# Altium schematic sheet 32点阵.SchDoc
size A2
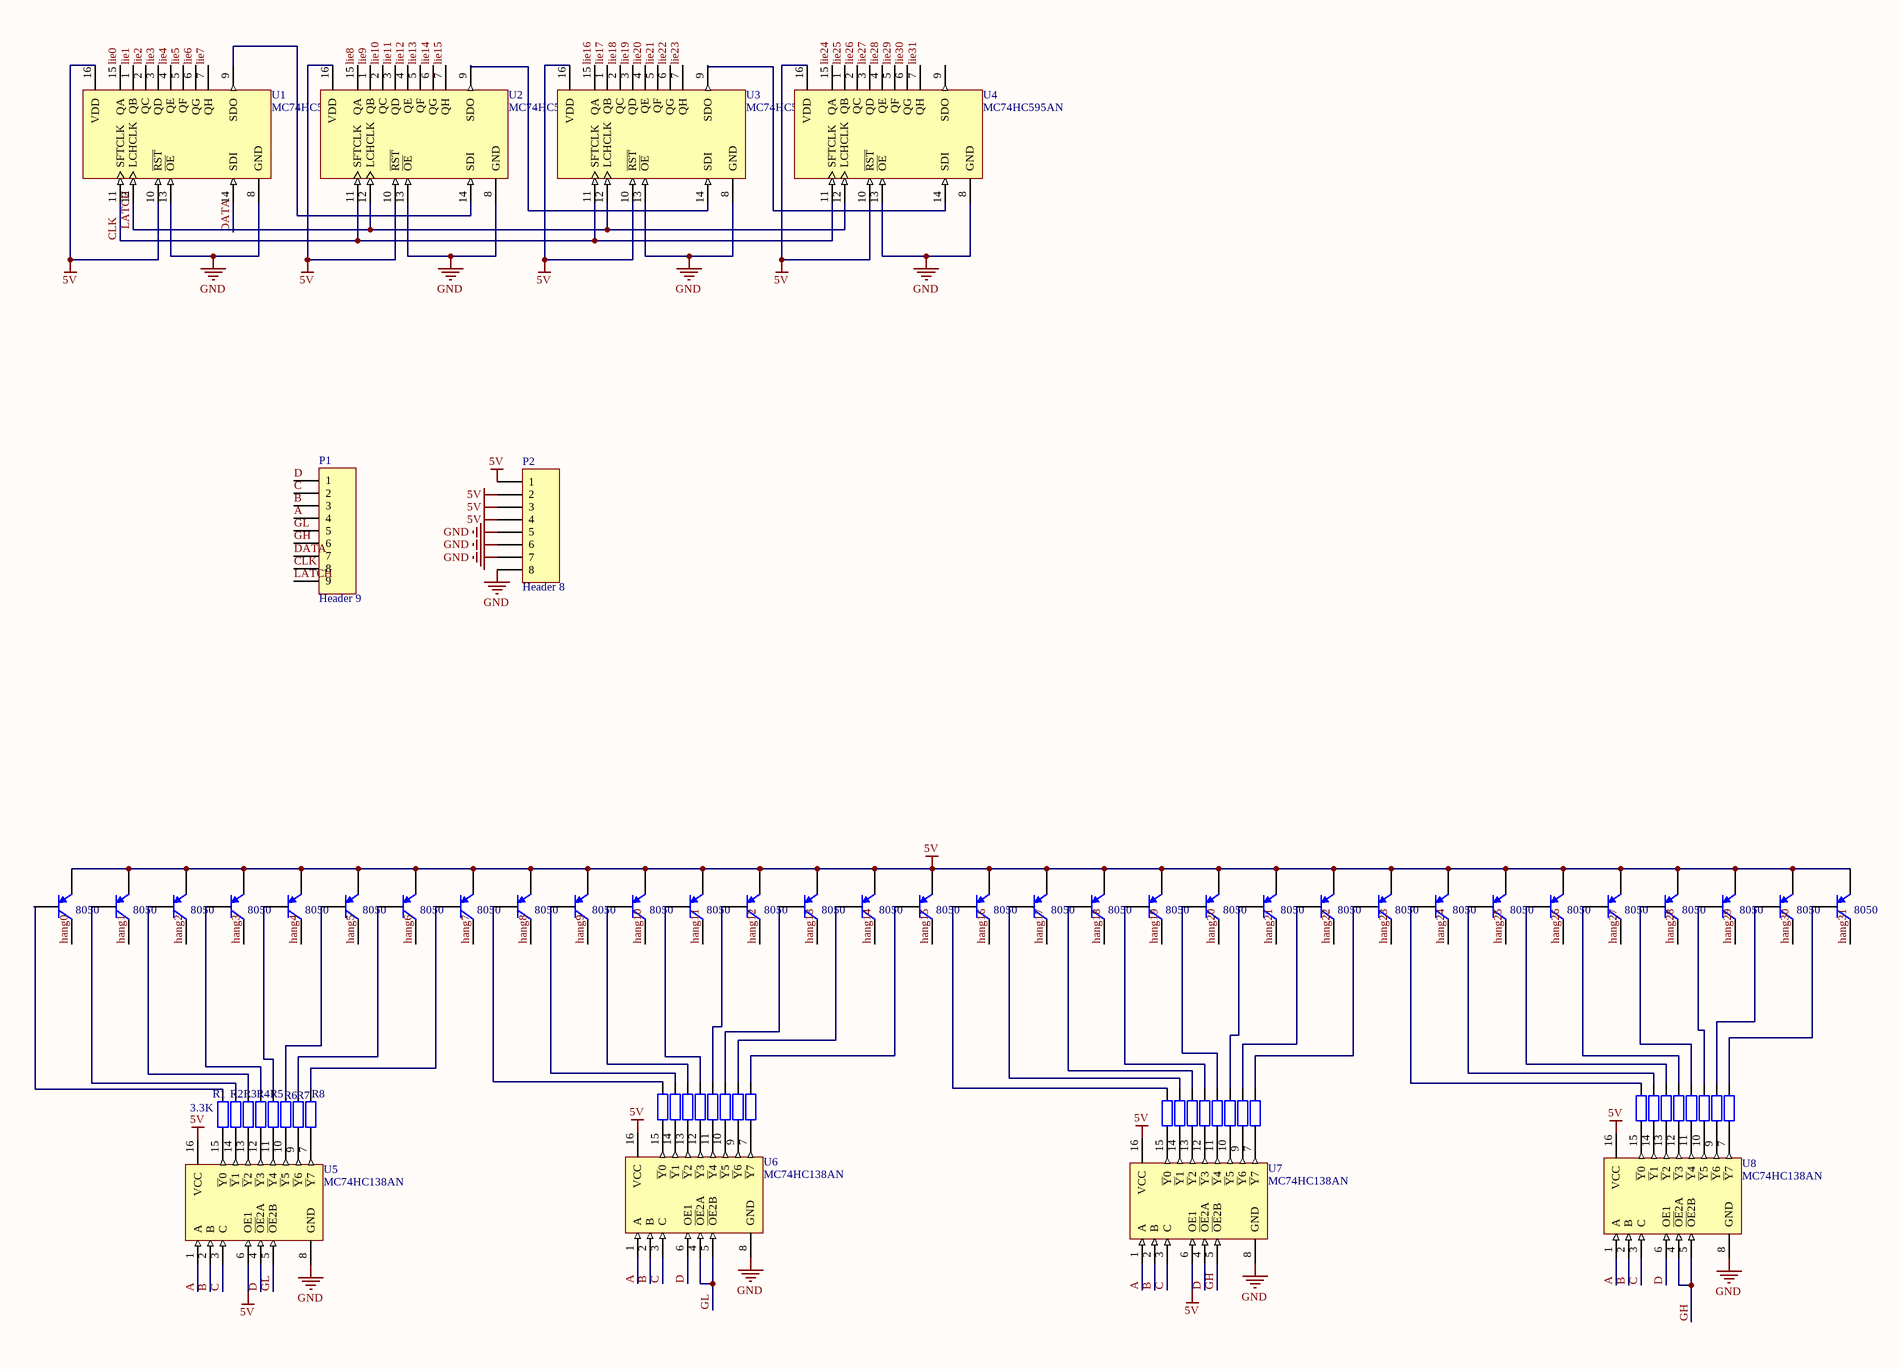
[diagram p0: 32点阵.SchDoc, left]
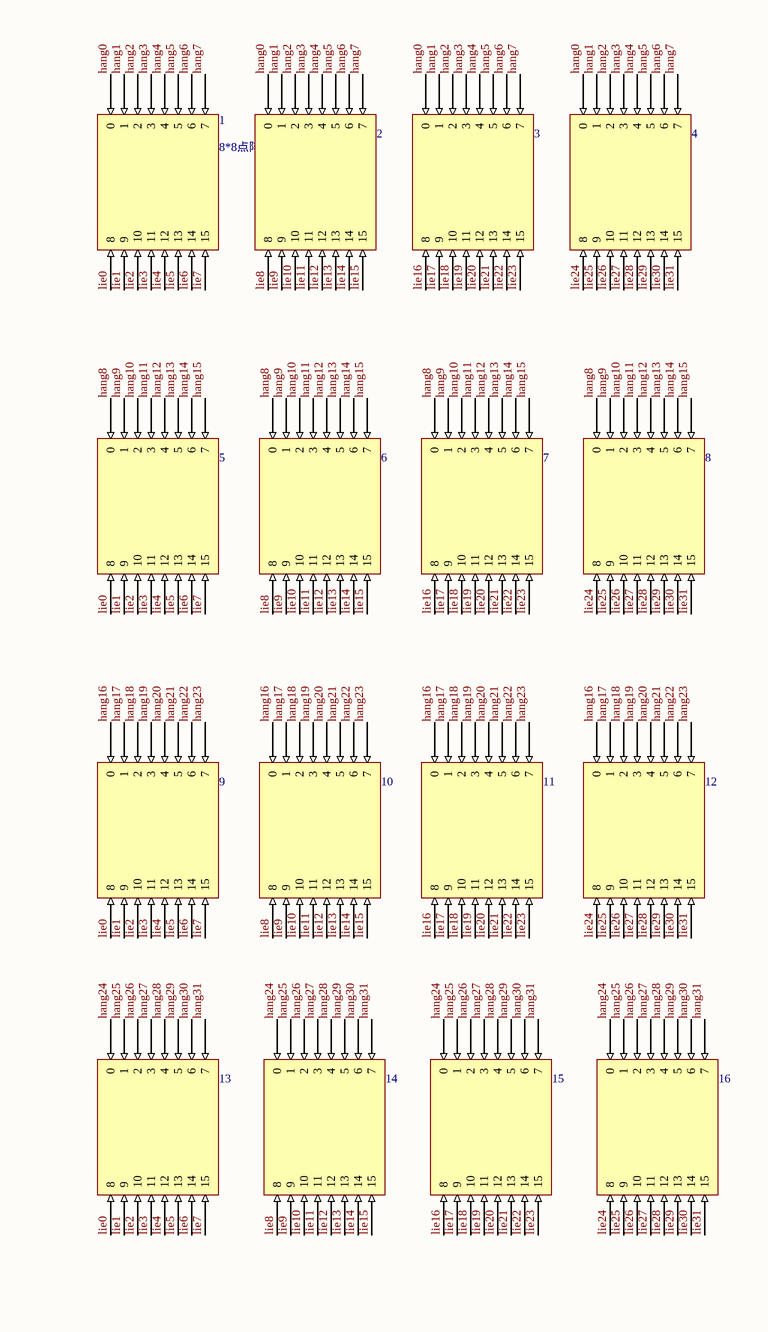
[diagram p1: 32点阵.SchDoc, right]

## Parts
1  8*8点阵: 上面行，下面列  [PCBComponent_1 - duplicate]  (hidden comment: 8乘8点阵)
2  8乘8点阵  [PCBComponent_1 - duplicate]  (value not drawn)
3  8乘8点阵  [PCBComponent_1 - duplicate]  (value not drawn)
4  8乘8点阵  [PCBComponent_1 - duplicate]  (value not drawn)
5  8乘8点阵  [PCBComponent_1 - duplicate]  (value not drawn)
6  8乘8点阵  [PCBComponent_1 - duplicate]  (value not drawn)
7  8乘8点阵  [PCBComponent_1 - duplicate]  (value not drawn)
8  8乘8点阵  [PCBComponent_1 - duplicate]  (value not drawn)
9  8乘8点阵  [PCBComponent_1 - duplicate]  (value not drawn)
10  8乘8点阵  [PCBComponent_1 - duplicate]  (value not drawn)
11  8乘8点阵  [PCBComponent_1 - duplicate]  (value not drawn)
12  8乘8点阵  [PCBComponent_1 - duplicate]  (value not drawn)
13  8乘8点阵  [PCBComponent_1 - duplicate]  (value not drawn)
14  8乘8点阵  [PCBComponent_1 - duplicate]  (value not drawn)
15  8乘8点阵  [PCBComponent_1 - duplicate]  (value not drawn)
16  8乘8点阵  [PCBComponent_1 - duplicate]  (value not drawn)
P1  Header 9  [HDR1X9]
P2  Header 8  [HDR1X8]
Q1  8050  [TO-92A]
Q2  8050  [TO-92A]
Q3  8050  [TO-92A]
Q4  8050  [TO-92A]
Q5  8050  [TO-92A]
Q6  8050  [TO-92A]
Q7  8050  [TO-92A]
Q8  8050  [TO-92A]
Q9  8050  [TO-92A]
Q10  8050  [TO-92A]
Q11  8050  [TO-92A]
Q12  8050  [TO-92A]
Q13  8050  [TO-92A]
Q14  8050  [TO-92A]
Q15  8050  [TO-92A]
Q16  8050  [TO-92A]
Q17  8050  [TO-92A]
Q18  8050  [TO-92A]
Q19  8050  [TO-92A]
Q20  8050  [TO-92A]
Q21  8050  [TO-92A]
Q22  8050  [TO-92A]
Q23  8050  [TO-92A]
Q24  8050  [TO-92A]
Q25  8050  [TO-92A]
Q26  8050  [TO-92A]
Q27  8050  [TO-92A]
Q28  8050  [TO-92A]
Q29  8050  [TO-92A]
Q30  8050  [TO-92A]
Q31  8050  [TO-92A]
Q32  8050  [TO-92A]
R1  value 3.3K  [AXIAL-0.4]  (hidden comment: Res2)
R2  Res2  [AXIAL-0.4]  (value not drawn)
R3  Res2  [AXIAL-0.4]  (value not drawn)
R4  Res2  [AXIAL-0.4]  (value not drawn)
R5  Res2  [AXIAL-0.4]  (value not drawn)
R6  Res2  [AXIAL-0.4]  (value not drawn)
R7  Res2  [AXIAL-0.4]  (value not drawn)
R8  Res2  [AXIAL-0.4]  (value not drawn)
R9  Res2  [AXIAL-0.4]  (value not drawn)
R10  Res2  [AXIAL-0.4]  (value not drawn)
R11  Res2  [AXIAL-0.4]  (value not drawn)
R12  Res2  [AXIAL-0.4]  (value not drawn)
R13  Res2  [AXIAL-0.4]  (value not drawn)
R14  Res2  [AXIAL-0.4]  (value not drawn)
R15  Res2  [AXIAL-0.4]  (value not drawn)
R16  Res2  [AXIAL-0.4]  (value not drawn)
R17  Res2  [AXIAL-0.4]  (value not drawn)
R18  Res2  [AXIAL-0.4]  (value not drawn)
R19  Res2  [AXIAL-0.4]  (value not drawn)
R20  Res2  [AXIAL-0.4]  (value not drawn)
R21  Res2  [AXIAL-0.4]  (value not drawn)
R22  Res2  [AXIAL-0.4]  (value not drawn)
R23  Res2  [AXIAL-0.4]  (value not drawn)
R24  Res2  [AXIAL-0.4]  (value not drawn)
R25  Res2  [AXIAL-0.4]  (value not drawn)
R26  Res2  [AXIAL-0.4]  (value not drawn)
R27  Res2  [AXIAL-0.4]  (value not drawn)
R28  Res2  [AXIAL-0.4]  (value not drawn)
R29  Res2  [AXIAL-0.4]  (value not drawn)
R30  Res2  [AXIAL-0.4]  (value not drawn)
R31  Res2  [AXIAL-0.4]  (value not drawn)
R32  Res2  [AXIAL-0.4]  (value not drawn)
U1  MC74HC595AN  [648-08]
U2  MC74HC595AN  [648-08]
U3  MC74HC595AN  [648-08]
U4  MC74HC595AN  [648-08]
U5  MC74HC138AN  [648-08]
U6  MC74HC138AN  [648-08]
U7  MC74HC138AN  [648-08]
U8  MC74HC138AN  [648-08]

## Nets
5V: P2.1 P2.2 P2.3 P2.4 Q1.1(E) Q2.1(E) Q3.1(E) Q4.1(E) Q5.1(E) Q6.1(E) Q7.1(E) Q8.1(E) Q9.1(E) Q10.1(E) Q11.1(E) Q12.1(E) Q13.1(E) Q14.1(E) Q15.1(E) Q16.1(E) Q17.1(E) Q18.1(E) Q19.1(E) Q20.1(E) Q21.1(E) Q22.1(E) Q23.1(E) Q24.1(E) Q25.1(E) Q26.1(E) Q27.1(E) Q28.1(E) Q29.1(E) Q30.1(E) Q31.1(E) Q32.1(E) U1.10(~{RST}) U1.16(VDD) U2.10(~{RST}) U2.16(VDD) U3.10(~{RST}) U3.16(VDD) U4.10(~{RST}) U4.16(VDD) U5.6(OE1) U5.16(VCC) U6.16(VCC) U7.6(OE1) U7.16(VCC) U8.16(VCC)
GND: P2.5 P2.6 P2.7 P2.8 U1.8(GND) U1.13(~{OE}) U2.8(GND) U2.13(~{OE}) U3.8(GND) U3.13(~{OE}) U4.8(GND) U4.13(~{OE}) U5.8(GND) U6.8(GND) U7.8(GND) U8.8(GND)
A: P1.4 U5.1(A) U6.1(A) U7.1(A) U8.1(A)
B: P1.3 U5.2(B) U6.2(B) U7.2(B) U8.2(B)
C: P1.2 U5.3(C) U6.3(C) U7.3(C) U8.3(C)
CLK: P1.8 U1.11(SFTCLK) U2.11(SFTCLK) U3.11(SFTCLK) U4.11(SFTCLK)
D: P1.1 U5.4(~{OE}2A) U6.6(OE1) U7.4(~{OE}2A) U8.6(OE1)
DATA: P1.7 U1.14(SDI)
GH: P1.6 U7.5(~{OE}2B) U8.4(~{OE}2A) U8.5(~{OE}2B)
GL: P1.5 U5.5(~{OE}2B) U6.4(~{OE}2A) U6.5(~{OE}2B)
hang0: 1.0 2.0 3.0 4.0 Q1.3(C)
hang1: 1.1 2.1 3.1 4.1 Q2.3(C)
hang2: 1.2 2.2 3.2 4.2 Q3.3(C)
hang3: 1.3 2.3 3.3 4.3 Q4.3(C)
hang4: 1.4 2.4 3.4 4.4 Q5.3(C)
hang5: 1.5 2.5 3.5 4.5 Q6.3(C)
hang6: 1.6 2.6 3.6 4.6 Q7.3(C)
hang7: 1.7 2.7 3.7 4.7 Q8.3(C)
hang8: 5.0 6.0 7.0 8.0 Q9.3(C)
hang9: 5.1 6.1 7.1 8.1 Q10.3(C)
hang10: 5.2 6.2 7.2 8.2 Q11.3(C)
hang11: 5.3 6.3 7.3 8.3 Q12.3(C)
hang12: 5.4 6.4 7.4 8.4 Q13.3(C)
hang13: 5.5 6.5 7.5 8.5 Q14.3(C)
hang14: 5.6 6.6 7.6 8.6 Q15.3(C)
hang15: 5.7 6.7 7.7 8.7 Q16.3(C)
hang16: 9.0 10.0 11.0 12.0 Q17.3(C)
hang17: 9.1 10.1 11.1 12.1 Q18.3(C)
hang18: 9.2 10.2 11.2 12.2 Q19.3(C)
hang19: 9.3 10.3 11.3 12.3 Q20.3(C)
hang20: 9.4 10.4 11.4 12.4 Q21.3(C)
hang21: 9.5 10.5 11.5 12.5 Q22.3(C)
hang22: 9.6 10.6 11.6 12.6 Q23.3(C)
hang23: 9.7 10.7 11.7 12.7 Q24.3(C)
hang24: 13.0 14.0 15.0 16.0 Q25.3(C)
hang25: 13.1 14.1 15.1 16.1 Q26.3(C)
hang26: 13.2 14.2 15.2 16.2 Q27.3(C)
hang27: 13.3 14.3 15.3 16.3 Q28.3(C)
hang28: 13.4 14.4 15.4 16.4 Q29.3(C)
hang29: 13.5 14.5 15.5 16.5 Q30.3(C)
hang30: 13.6 14.6 15.6 16.6 Q31.3(C)
hang31: 13.7 14.7 15.7 16.7 Q32.3(C)
LATCH: P1.9 U1.12(LCHCLK) U2.12(LCHCLK) U3.12(LCHCLK) U4.12(LCHCLK)
lie0: 1.8 5.8 9.8 13.8 U1.15(QA)
lie1: 1.9 5.9 9.9 13.9 U1.1(QB)
lie2: 1.10 5.10 9.10 13.10 U1.2(QC)
lie3: 1.11 5.11 9.11 13.11 U1.3(QD)
lie4: 1.12 5.12 9.12 13.12 U1.4(QE)
lie5: 1.13 5.13 9.13 13.13 U1.5(QF)
lie6: 1.14 5.14 9.14 13.14 U1.6(QG)
lie7: 1.15 5.15 9.15 13.15 U1.7(QH)
lie8: 2.8 6.8 10.8 14.8 U2.15(QA)
lie9: 2.9 6.9 10.9 14.9 U2.1(QB)
lie10: 2.10 6.10 10.10 14.10 U2.2(QC)
lie11: 2.11 6.11 10.11 14.11 U2.3(QD)
lie12: 2.12 6.12 10.12 14.12 U2.4(QE)
lie13: 2.13 6.13 10.13 14.13 U2.5(QF)
lie14: 2.14 6.14 10.14 14.14 U2.6(QG)
lie15: 2.15 6.15 10.15 14.15 U2.7(QH)
lie16: 3.8 7.8 11.8 15.8 U3.15(QA)
lie17: 3.9 7.9 11.9 15.9 U3.1(QB)
lie18: 3.10 7.10 11.10 15.10 U3.2(QC)
lie19: 3.11 7.11 11.11 15.11 U3.3(QD)
lie20: 3.12 7.12 11.12 15.12 U3.4(QE)
lie21: 3.13 7.13 11.13 15.13 U3.5(QF)
lie22: 3.14 7.14 11.14 15.14 U3.6(QG)
lie23: 3.15 7.15 11.15 15.15 U3.7(QH)
lie24: 4.8 8.8 12.8 16.8 U4.15(QA)
lie25: 4.9 8.9 12.9 16.9 U4.1(QB)
lie26: 4.10 8.10 12.10 16.10 U4.2(QC)
lie27: 4.11 8.11 12.11 16.11 U4.3(QD)
lie28: 4.12 8.12 12.12 16.12 U4.4(QE)
lie29: 4.13 8.13 12.13 16.13 U4.5(QF)
lie30: 4.14 8.14 12.14 16.14 U4.6(QG)
lie31: 4.15 8.15 12.15 16.15 U4.7(QH)
NetQ1_2: Q1.2(B) R1.2
NetQ2_2: Q2.2(B) R2.2
NetQ3_2: Q3.2(B) R3.2
NetQ4_2: Q4.2(B) R4.2
NetQ5_2: Q5.2(B) R5.2
NetQ6_2: Q6.2(B) R6.2
NetQ7_2: Q7.2(B) R7.2
NetQ8_2: Q8.2(B) R8.2
NetQ9_2: Q9.2(B) R9.2
NetQ10_2: Q10.2(B) R10.2
NetQ11_2: Q11.2(B) R11.2
NetQ12_2: Q12.2(B) R12.2
NetQ13_2: Q13.2(B) R13.2
NetQ14_2: Q14.2(B) R14.2
NetQ15_2: Q15.2(B) R15.2
NetQ16_2: Q16.2(B) R16.2
NetQ17_2: Q17.2(B) R17.2
NetQ18_2: Q18.2(B) R18.2
NetQ19_2: Q19.2(B) R19.2
NetQ20_2: Q20.2(B) R20.2
NetQ21_2: Q21.2(B) R21.2
NetQ22_2: Q22.2(B) R22.2
NetQ23_2: Q23.2(B) R23.2
NetQ24_2: Q24.2(B) R24.2
NetQ25_2: Q25.2(B) R25.2
NetQ26_2: Q26.2(B) R26.2
NetQ27_2: Q27.2(B) R27.2
NetQ28_2: Q28.2(B) R28.2
NetQ29_2: Q29.2(B) R29.2
NetQ30_2: Q30.2(B) R30.2
NetQ31_2: Q31.2(B) R31.2
NetQ32_2: Q32.2(B) R32.2
NetR1_1: R1.1 U5.15(~{Y}0)
NetR2_1: R2.1 U5.14(~{Y}1)
NetR3_1: R3.1 U5.13(~{Y}2)
NetR4_1: R4.1 U5.12(~{Y}3)
NetR5_1: R5.1 U5.11(~{Y}4)
NetR6_1: R6.1 U5.10(~{Y}5)
NetR7_1: R7.1 U5.9(~{Y}6)
NetR8_1: R8.1 U5.7(~{Y}7)
NetR9_1: R9.1 U6.15(~{Y}0)
NetR10_1: R10.1 U6.14(~{Y}1)
NetR11_1: R11.1 U6.13(~{Y}2)
NetR12_1: R12.1 U6.12(~{Y}3)
NetR13_1: R13.1 U6.11(~{Y}4)
NetR14_1: R14.1 U6.10(~{Y}5)
NetR15_1: R15.1 U6.9(~{Y}6)
NetR16_1: R16.1 U6.7(~{Y}7)
NetR17_1: R17.1 U7.15(~{Y}0)
NetR18_1: R18.1 U7.14(~{Y}1)
NetR19_1: R19.1 U7.13(~{Y}2)
NetR20_1: R20.1 U7.12(~{Y}3)
NetR21_1: R21.1 U7.11(~{Y}4)
NetR22_1: R22.1 U7.10(~{Y}5)
NetR23_1: R23.1 U7.9(~{Y}6)
NetR24_1: R24.1 U7.7(~{Y}7)
NetR25_1: R25.1 U8.15(~{Y}0)
NetR26_1: R26.1 U8.14(~{Y}1)
NetR27_1: R27.1 U8.13(~{Y}2)
NetR28_1: R28.1 U8.12(~{Y}3)
NetR29_1: R29.1 U8.11(~{Y}4)
NetR30_1: R30.1 U8.10(~{Y}5)
NetR31_1: R31.1 U8.9(~{Y}6)
NetR32_1: R32.1 U8.7(~{Y}7)
NetU1_9: U1.9(SDO) U2.14(SDI)
NetU2_9: U2.9(SDO) U3.14(SDI)
NetU3_9: U3.9(SDO) U4.14(SDI)

Not connected (* = marked no-connect by the designer): U4 9(SDO)

## Library data of the parts
2-16 = 8乘8点阵: 8*8点阵: 上面行，下面列
P1 = Header 9: Header, 9-Pin; LatestRevisionDate: 17-Jul-2002; LatestRevisionNote: Re-released for DXP Platform.; Publisher: Altium Limited
P2 = Header 8: Header, 8-Pin; LatestRevisionDate: 17-Jul-2002; LatestRevisionNote: Re-released for DXP Platform.; Publisher: Altium Limited
Q1-Q32 = 2N3906: PNP General Purpose Amplifier; Published: 8-Jun-2000; LatestRevisionDate: 15-Jan-2003; LatestRevisionNote: PCB Footprint 'BCY-W3/D4.7' replaced; DatasheetDocument: 1997; PackageDocument: Sep-1998; PackageReference: TO-92A; Publisher: Altium Limited; Code_JEDEC: TO-92A; ComponentLink1Description: Manufacturer Link; ComponentLink1URL: http://www.fairchildsemi.com/; ComponentLink2Description: Datasheet; ComponentLink2URL: http://www.fairchildsemi.com/ds/2N%2F2N3906.pdf
R1-R8 = Res2: Resistor; Published: 8-Jun-2000; LatestRevisionDate: 17-Jul-2002; LatestRevisionNote: Re-released for DXP Platform.; PackageReference: AXIAL-0.4; Publisher: Altium Limited
R9-R32 = Res2: Resistor; Value: 3.3K; Published: 8-Jun-2000; LatestRevisionDate: 17-Jul-2002; LatestRevisionNote: Re-released for DXP Platform.; PackageReference: AXIAL-0.4; Publisher: Altium Limited
U1-U4 = MC74HC595AN: 8-Bit Serial-Input/Serial or Prallel-Output Shift Register with Latched 3-State Outputs; Published: 15-Apr-2002; DatasheetVersion: Mar-2000; PackageVersion: Apr-2000; PackageReference: 648-08; Publisher: Altium Limited; PackageDescription: DIP; 16 Leads; Row Spacing 7.62 mm; Pitch 2.54 mm; Code_JEDEC: MS-001-BB; ComponentLink1Description: Manufacturer Link; ComponentLink1URL: http://www.onsemi.com/; ComponentLink2Description: Datasheet; ComponentLink2URL: http://www.onsemi.com/pub/Collateral/MC74HC595A-D.PDF
U5-U8 = MC74HC138AN: 1-of-8 Decoder/Demultiplexer; Published: 15-Apr-2002; DatasheetVersion: Mar-2000; PackageVersion: Apr-2000; PackageReference: 648-08; Publisher: Altium Limited; PackageDescription: DIP; 16 Leads; Row Spacing 7.62 mm; Pitch 2.54 mm; Code_JEDEC: MS-001-BB; ComponentLink1Description: Manufacturer Link; ComponentLink1URL: http://www.onsemi.com/; ComponentLink2Description: Datasheet; ComponentLink2URL: http://www.onsemi.com/pub/Collateral/MC74HC138A-D.PDF